# EAGLE schematic kitt_db01 (EAGLE 7.6.0)
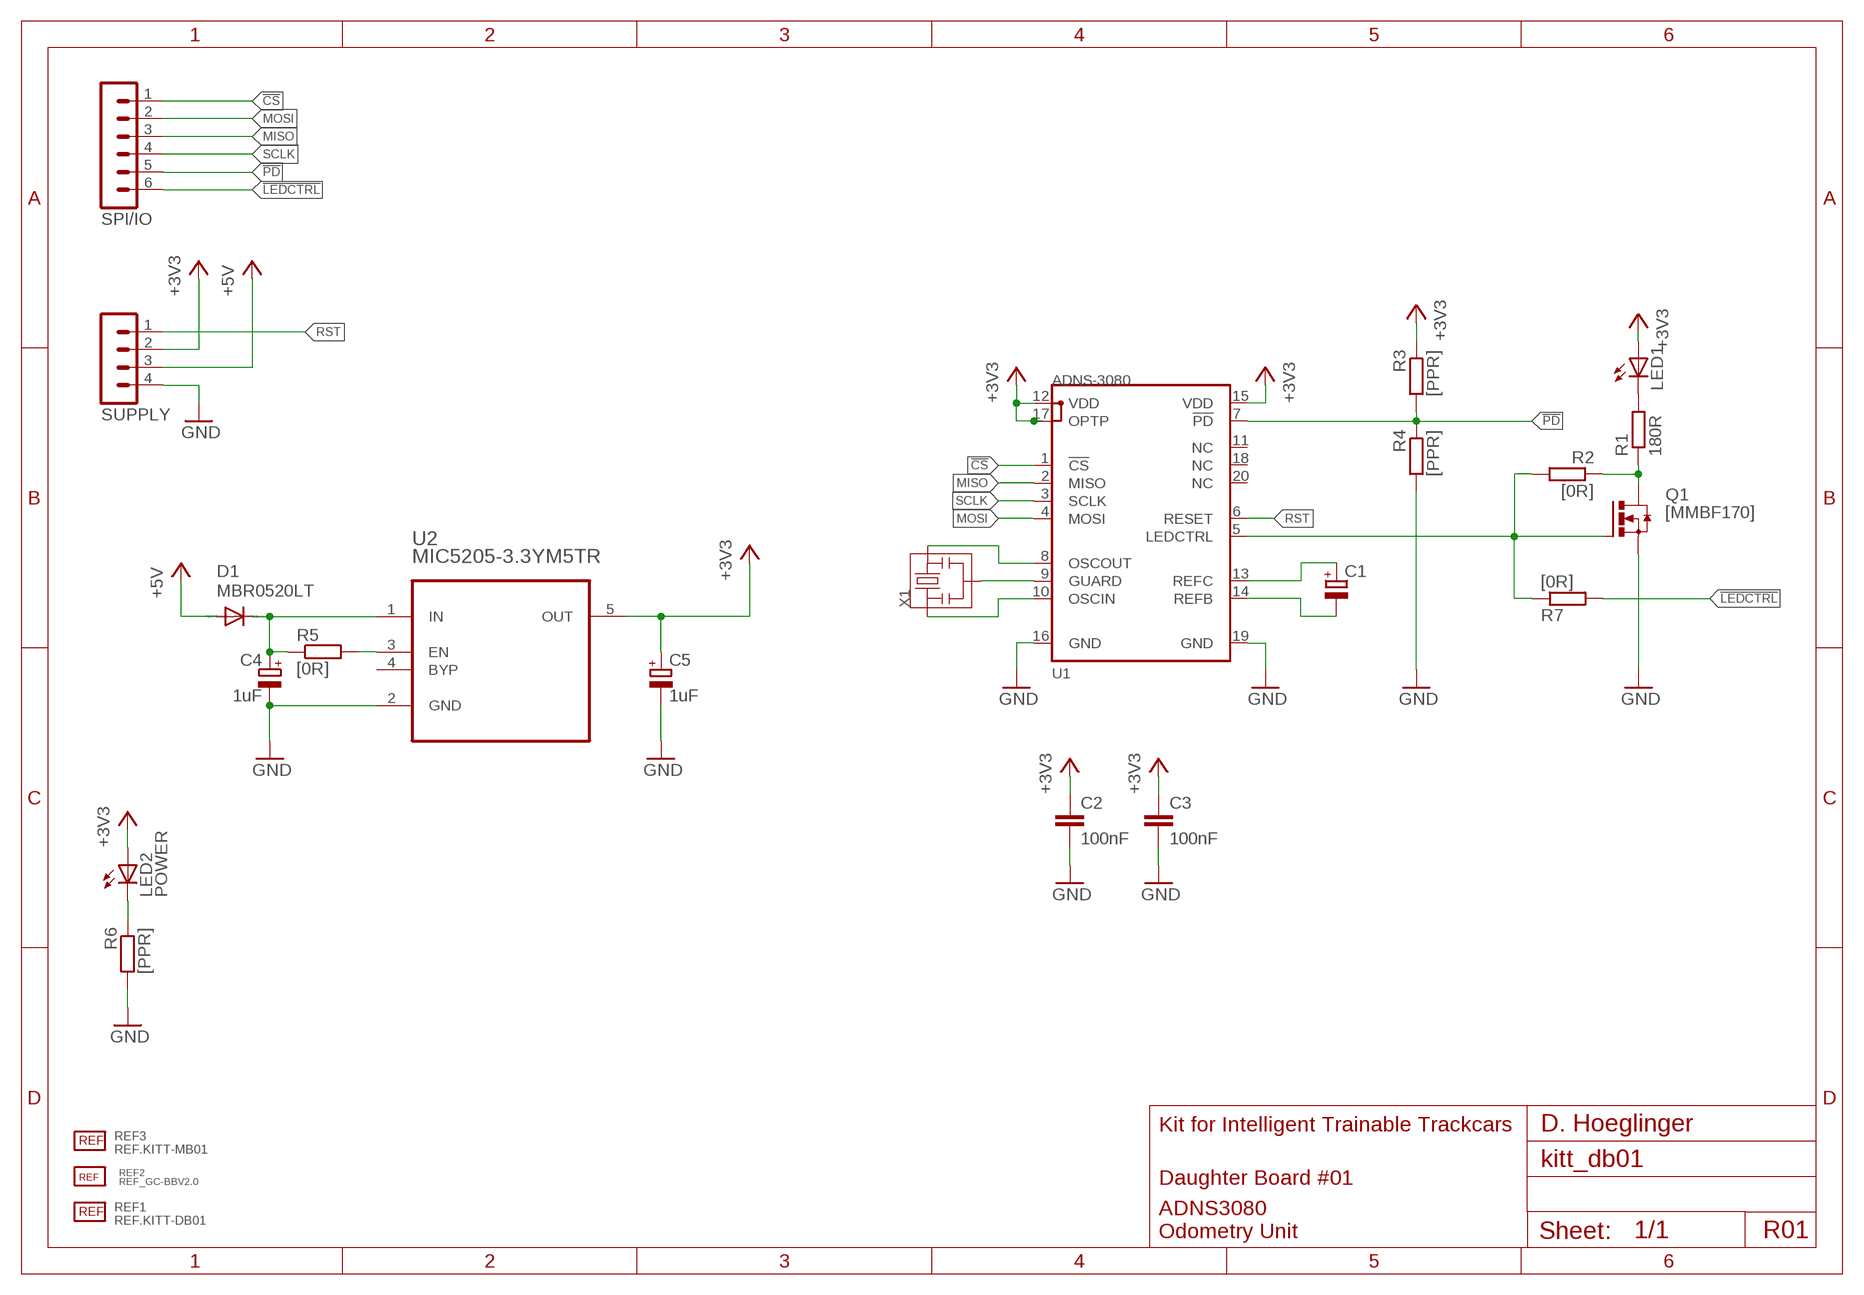
[diagram p0: schematic, sheet 1]

## Parts
C1  CPOL-EUSMCB  [SMC_B]
C2  100nF  C-EUC0805K  [C0805K]
C3  100nF  C-EUC0805K  [C0805K]
C4  1uF  CPOL-EUA/3216-18W  [A/3216-18W]
C5  1uF  CPOL-EUA/3216-18W  [A/3216-18W]
D1  MBR0520LT  [SOD123]
LED1  LED5MM  [LED5MM]
LED2  POWER  LEDCHIP-LED0805  [CHIP-LED0805]
Q1  [MMBF170]  N-HEXFET-2D_SOT232-  [SOT223]
R1  180R  R-EU_R0805  [R0805]
R2  [0R]  R-EU_R0805  [R0805]
R3  [PPR]  R-EU_R0805  [R0805]
R4  [PPR]  R-EU_R0805  [R0805]
R5  [0R]  R-EU_R0805  [R0805]
R6  [PPR]  R-EU_R0805  [R0805]
R7  [0R]  R-EU_R0805  [R0805]
REF1  REF.KITT-DB01  [REF_KITT-DB01]
REF2  REF_GC-BBV2.0  [REF_GHOSTCAR]
REF3  REF.KITT-MB01  [REF_KITT_MB01]
SPI/IO  MA06-1  [MA06-1]
SUPPLY  MA04-1  [MA04-1]
U1  ADNS-3080  [ADNS-3080]
U2  MIC5205-3.3YM5TR  [SOT95P280X130-5N]
X1  RESON  [RESON-SMD]

## Nets
!CS: SPI/IO.1 U1.1(!CS)
!LEDCTRL: R7.2 SPI/IO.6
!PD: R3.2 R4.1 SPI/IO.5 U1.7(!PD)
+3V3: C2.1 C3.1 C5.+ LED1.A LED2.A R3.1 SUPPLY.2 U1.12(VDD) U1.15(VDD) U1.17(OPTP) U2.5(OUT)
+5V: D1.A SUPPLY.3
GND: C2.2 C3.2 C4.- C5.- Q1.3(S) R4.2 R6.2 SUPPLY.4 U1.16(GND) U1.19(GND) U2.2(GND)
MISO: SPI/IO.3 U1.2(MISO)
MOSI: SPI/IO.2 U1.4(MOSI)
N$1: U1.9(GUARD) X1.2
N$2: U1.8(OSCOUT) X1.3
N$3: U1.10(OSCIN) X1.1
N$4: Q1.1(G) R2.2 R7.1 U1.5(LEDCTRL)
N$5: C1.+ U1.13(REFC)
N$6: C1.- U1.14(REFB)
N$7: Q1.2(D) Q1.4(D) R1.1 R2.1
N$8: LED1.K(C) R1.2
N$9: C4.+ D1.C R5.1 U2.1(IN)
N$10: R5.2 U2.3(EN)
N$11: LED2.C R6.1
RST: SUPPLY.1 U1.6(RESET)
SCLK: SPI/IO.4 U1.3(SCLK)
Unconnected: U1.11(NC) U1.18(NC) U1.20(NC) U2.4(BYP)

## Notes on the sheet
- Kit for Intelligent Trainable Trackcars | D. Hoeglinger
- Daughter Board #01
- ADNS3080
  Odometry Unit
- R01

## Library data of the parts
C1 C4 C5 = rcl:CPOL-EU: POLARIZED CAPACITOR, European symbol
C2 C3 = rcl:C-EU: CAPACITOR, European symbol
D1 = diode:MBR0520LT: SCHOTTKY BARRIER RECTIFIER Source: http://onsemi.com .. MBR0520LT1-D.pdf
LED1 LED2 = led:LED: LED OSRAM: - CHIPLED LG R971, LG N971, LY N971, LG Q971, LY Q971, LO R971, LY R971 LH N974, LH R974 LS Q976, LO Q976, LY Q976 LO Q996 - Hyper CHIPLED LW Q18S LB Q993, LB Q99A, LB R99A - SideLED LS A670, LO A670, LY A670, LG A670, LP A670 LB A673, LV A673, LT A673, LW A673 LH A674 LY A675 LS A676, LA A676, LO A676, LY A676, LW A676 LS A679, LY A679, LG A679 - Hyper Micro SIDELED® LS Y876, LA Y876, LO Y876, LY Y876 LT Y87S - SmartLED LW L88C, LW L88S LB L89C, LB L89S, LG L890 LS L89K, LO L89K, LY L89K LS L896, LA L896, LO L896, LY L896 - TOPLED LS T670, LO T670, LY T670, LG T670, LP T670 LSG T670, LSP T670, LSY T670, LOP T670, LYG T670 LG T671, LOG T671, LSG T671 LB T673, LV T673, LT T673, LW T673 LH T674 LS T676, LA T676, LO T676, LY T676, LB T676, LH T676, LSB T676, LW T676 LB T67C, LV T67C, LT T67C, LS T67K, LO T67K, LY T67K, LW E67C LS E67B, LA E67B, LO E67B, LY E67B, LB E67C, LV E67C, LT E67C LW T67C LS T679, LY T679, LG T679 LS T770, LO T770, LY T770, LG T770, LP T770 LB T773, LV T773, LT T773, LW T773 LH T774 LS E675, LA E675, LY E675, LS T675 LS T776, LA T776, LO T776, LY T776, LB T776 LHGB T686 LT T68C, LB T68C - Hyper Mini TOPLED® LB M676 - Mini TOPLED Santana® LG M470 LS M47K, LO M47K, LY M47K Source: http://www.osram.convergy.de LUXEON: - LUMILED® LXK2-PW12-R00, LXK2-PW12-S00, LXK2-PW14-U00, LXK2-PW14-V00 LXK2-PM12-R00, LXK2-PM12-S00, LXK2-PM14-U00 LXK2-PE12-Q00, LXK2-PE12-R00, LXK2-PE12-S00, LXK2-PE14-T00, LXK2-PE14-U00 LXK2-PB12-K00, LXK2-PB12-L00, LXK2-PB12-M00, LXK2-PB14-N00, LXK2-PB14-P00, LXK2-PB14-Q00 LXK2-PR12-L00, LXK2-PR12-M00, LXK2-PR14-Q00, LXK2-PR14-R00 LXK2-PD12-Q00, LXK2-PD12-R00, LXK2-PD12-S00 LXK2-PH12-R00, LXK2-PH12-S00 LXK2-PL12-P00, LXK2-PL12-Q00, LXK2-PL12-R00 Source: www.luxeon.com KINGBRIGHT: KA-3528ASYC Source: www.kingbright.com
Q1 = transistor-power:N-HEXFET-2D_?-*: HEXFET® Power MOSFET 2 Drain connects http://www.irf.com/product-info/datasheets/data/irll014n.pdf
R1-R7 = rcl:R-EU_: RESISTOR, European symbol
REF1 = kitt.refs:REF.KITT-DB01
REF2 = kitt.con:REF_GC-BBV2.0
REF3 = kitt.refs:REF.KITT-MB01
SPI/IO = con-lstb:MA06-1: PIN HEADER; OC_FARNELL: unknown; OC_NEWARK: unknown
SUPPLY = con-lstb:MA04-1: PIN HEADER; OC_FARNELL: unknown; OC_NEWARK: unknown
U1 = Ai_IC:ADNS-3080
U2 = kitt.ic:MIC5205-3.3YM5TR: 150mA Low-Noise LDO Regulator; AVAILABILITY: Good; DESCRIPTION: MIC5205 Series 3.3 V Fixed Output 150 mA Low-Noise LDO Regulator - SOT-23-5; MF: Microchip; MP: MIC5205-3.3YM5-TR; PACKAGE: SOT-23-5 Microchip; PRICE: 0.36 USD
X1 = Ai_Passives:RESON